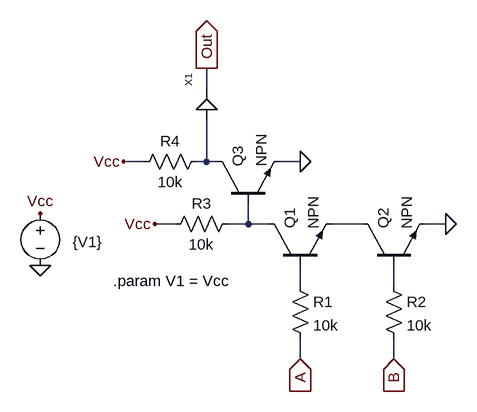
[diagram p0: schematic AND.asc]
AND.asc, the LTspice schematic file:
Version 4
SHEET 1 880 680
WIRE -16 -192 -16 -224
WIRE -112 -80 -144 -80
WIRE -16 -80 -16 -144
WIRE -16 -80 -32 -80
WIRE 0 -80 -16 -80
WIRE 128 -80 96 -80
WIRE -64 16 -96 16
WIRE 48 16 48 -16
WIRE 48 16 16 16
WIRE 80 16 48 16
WIRE 224 16 176 16
WIRE 352 16 320 16
WIRE 128 112 128 80
WIRE 272 112 272 80
WIRE 128 224 128 192
WIRE 272 224 272 192
FLAG 128 224 A
IOPIN 128 224 In
FLAG 272 224 B
IOPIN 272 224 In
FLAG -16 -224 Out
IOPIN -16 -224 Out
FLAG 128 -80 0
FLAG 352 16 0
FLAG -144 -80 Vcc
FLAG -96 16 Vcc
FLAG -272 80 0
FLAG -272 0 Vcc
SYMBOL res 112 96 R0
SYMATTR InstName R1
SYMATTR Value 10k
SYMBOL res 256 96 R0
SYMATTR InstName R2
SYMATTR Value 10k
SYMBOL res 32 0 R90
WINDOW 0 0 56 VBottom 2
WINDOW 3 32 56 VTop 2
SYMATTR InstName R3
SYMATTR Value 10k
SYMBOL npn 80 80 R270
SYMATTR InstName Q1
SYMBOL npn 224 80 R270
SYMATTR InstName Q2
SYMBOL res -16 -96 R90
WINDOW 0 0 56 VBottom 2
WINDOW 3 32 56 VTop 2
SYMATTR InstName R4
SYMATTR Value 10k
SYMBOL npn 0 -16 R270
SYMATTR InstName Q3
SYMBOL Buffer -16 -144 R270
SYMATTR InstName X1
SYMATTR SpiceLine Vcc = 5
SYMBOL voltage -272 -16 R0
WINDOW 0 24 16 Invisible 2
WINDOW 3 50 60 Left 2
SYMATTR InstName V1
SYMATTR Value {V1}
TEXT -160 104 Left 2 !.param V1 = Vcc

The netlist it stands for:
* AND.asc
R1 N004 A 10k
R2 N005 B 10k
R3 N002 Vcc 10k
Q1 N002 N004 N003 0 NPN
Q2 N003 N005 0 0 NPN
R4 N001 Vcc 10k
Q3 N001 N002 0 0 NPN
XX1 N001 Out Buffer Vcc = 5  ; pins In Out
V1 Vcc 0 {V1}
.model NPN NPN
.model PNP PNP
.lib standard.bjt
.param V1 = Vcc
.backanno
.end